# EasyEDA schematic ROBOT_SENSORS.json
TITLE: Sheet_1; REV: 1.0; Date: 2025-04-17; Sheet: 1/1; Drawn By: AmirB; Company: Your Company
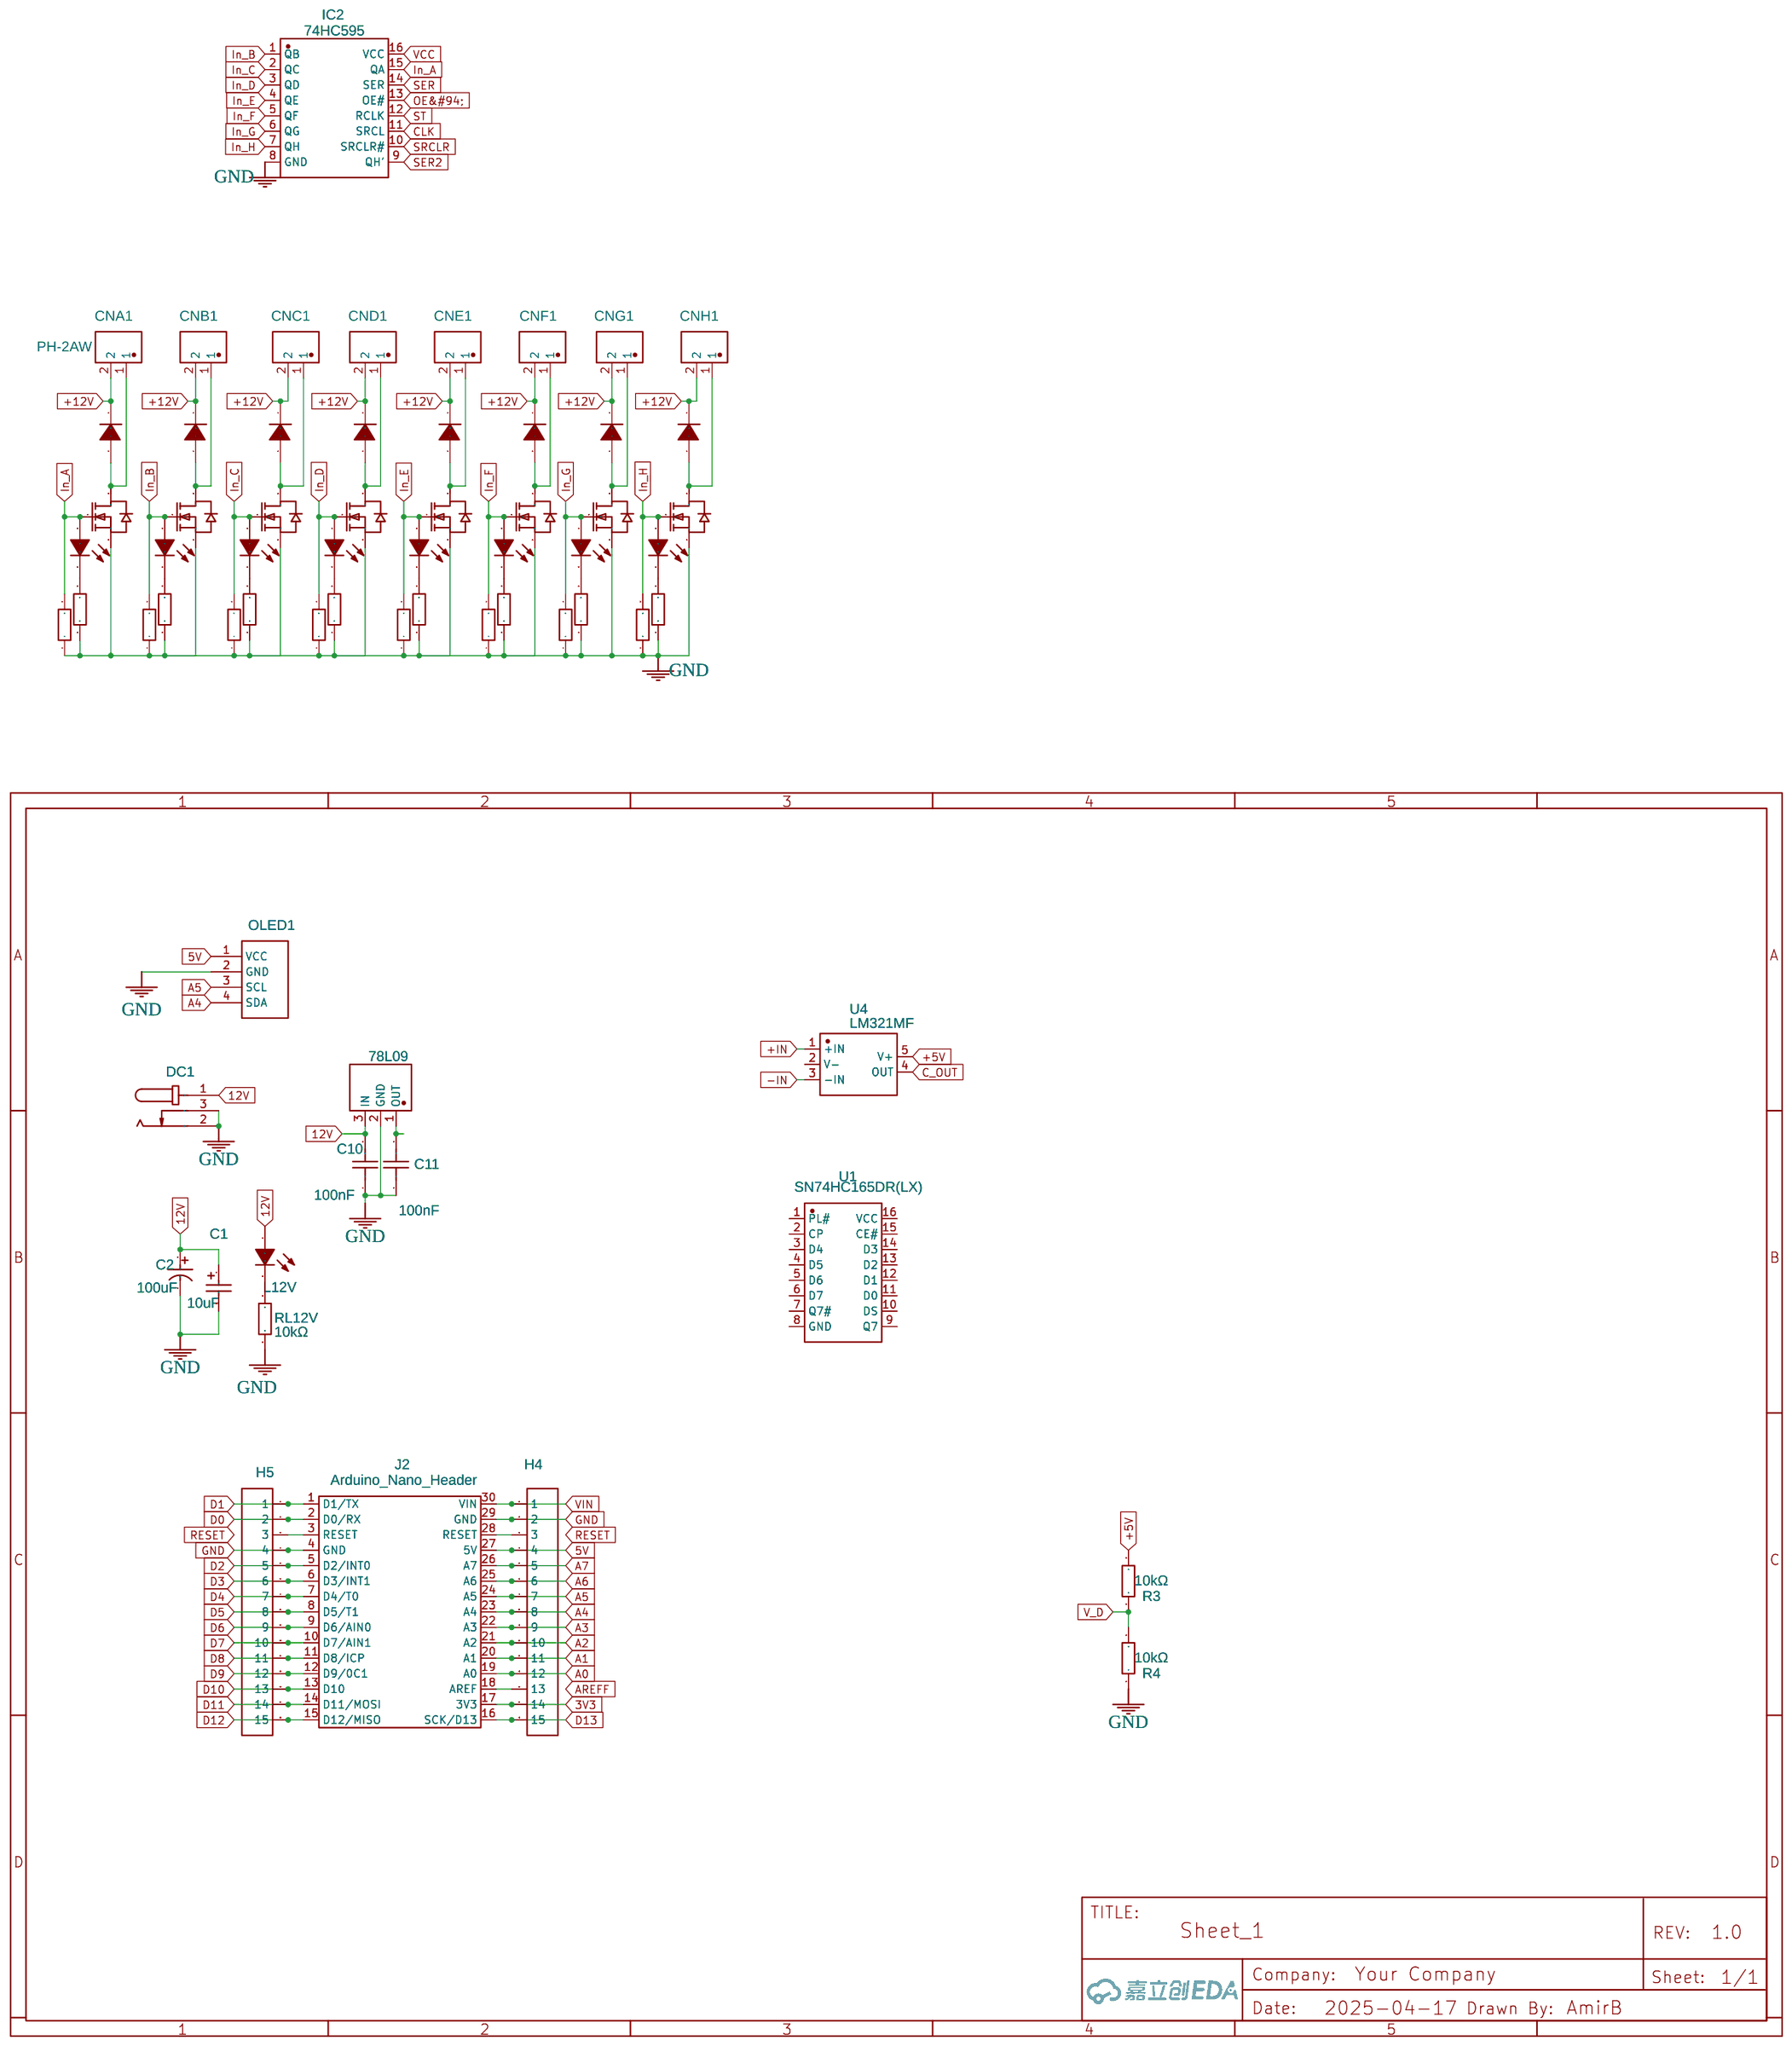
[diagram p0: schematic sheet]

## Parts
AD1  D  [SMA_L4.3-W2.6-LS5.2-RD]
ALED1  LED  [LED0603-R-RD_BLUE]
AQ1  Q  [SOT-23-3_L2.9-W1.3-P0.95-LS2.4-BR]
AR1  R10K  [R0603]
AR2  R10K  [R0603]
BD1  D  [SMA_L4.3-W2.6-LS5.2-RD]
BLED1  LED  [LED0603-R-RD_BLUE]
BQ1  Q  [SOT-23-3_L2.9-W1.3-P0.95-LS2.4-BR]
BR1  R10K  [R0603]
BR2  R10K  [R0603]
C1  10uF  [CAP-SMD_L3.2-W1.6-RD-C7171]
C2  100uF  [CAP-TH_BD6.3-P2.50-D1.0-FD]
C10  100nF  [C0603]
C11  100nF  [C0603]
CD1  D  [SMA_L4.3-W2.6-LS5.2-RD]
CLED1  LED  [LED0603-R-RD_BLUE]
CNA1  PH-2AW  [CONN-TH_PH-2AW]
CNB1  PH-2AW  [CONN-TH_PH-2AW]
CNC1  PH-2AW  [CONN-TH_PH-2AW]
CND1  PH-2AW  [CONN-TH_PH-2AW]
CNE1  PH-2AW  [CONN-TH_PH-2AW]
CNF1  PH-2AW  [CONN-TH_PH-2AW]
CNG1  PH-2AW  [CONN-TH_PH-2AW]
CNH1  PH-2AW  [CONN-TH_PH-2AW]
CQ1  Q  [SOT-23-3_L2.9-W1.3-P0.95-LS2.4-BR]
CR1  R10K  [R0603]
CR2  R10K  [R0603]
DC1  DC  [DC-IN-TH_DC005]
DD1  D  [SMA_L4.3-W2.6-LS5.2-RD]
DLED1  LED  [LED0603-R-RD_BLUE]
DQ1  Q  [SOT-23-3_L2.9-W1.3-P0.95-LS2.4-BR]
DR1  R10K  [R0603]
DR2  R10K  [R0603]
ED1  D  [SMA_L4.3-W2.6-LS5.2-RD]
ELED1  LED  [LED0603-R-RD_BLUE]
EQ1  Q  [SOT-23-3_L2.9-W1.3-P0.95-LS2.4-BR]
ER1  R10K  [R0603]
ER2  R10K  [R0603]
FD1  D  [SMA_L4.3-W2.6-LS5.2-RD]
FLED1  LED  [LED0603-R-RD_BLUE]
FQ1  Q  [SOT-23-3_L2.9-W1.3-P0.95-LS2.4-BR]
FR1  R10K  [R0603]
FR2  R10K  [R0603]
GD1  D  [SMA_L4.3-W2.6-LS5.2-RD]
GLED1  LED  [LED0603-R-RD_BLUE]
GQ1  Q  [SOT-23-3_L2.9-W1.3-P0.95-LS2.4-BR]
GR1  R10K  [R0603]
GR2  R10K  [R0603]
H4  HDR-F-2.54_1x15  [HDR-F-2.54_1X15]
H5  HDR-F-2.54_1x15  [HDR-F-2.54_1X15]
HD1  D  [SMA_L4.3-W2.6-LS5.2-RD]
HLED1  LED  [LED0603-R-RD_BLUE]
HQ1  Q  [SOT-23-3_L2.9-W1.3-P0.95-LS2.4-BR]
HR1  R10K  [R0603]
HR2  R10K  [R0603]
IC2  74HC595  [SOP-16_L10.0-W3.9-P1.27-LS6.0-BL]
J2  Arduino_Nano_Header  [DIP-30_L43.18-W15.24-ARDUINONANO]
L12V  LED  [LED0603-R-RD_BLUE]
OLED1  1.3 inch OLED SSH1106 I2C 128x64 copy  [1.3_OLED_SSH1106_I2C_128X64_BOARD]
R3  10kΩ  [R0603]
R4  10kΩ  [R0603]
RL12V  10kΩ  [R0603]
U1  SN74HC165DR(LX)  [SOP-16_L10.0-W3.9-P1.27-LS6.0-BL]
U4  LM321MF  [SOT-23-5_L2.9-W1.6-P0.95-LS2.8-BL]
U5  78L09  [SOT-89-3_L4.5-W2.5-P1.50-LS4.0-BR]

## Library data of the parts
AD1 BD1 CD1 DD1 ED1 FD1 GD1 HD1 = 1N4007F: Supplier: LCSC; Manufacturer: 晶导微电子; Manufacturer Part: ES1J; Supplier Part: C115404; JLCPCB Part Class: Extended Part; Package Display: No
ALED1 BLED1 CLED1 DLED1 ELED1 FLED1 GLED1 HLED1 L12V = 19-217/BHC-ZL1M2RY/3T: Supplier: LCSC; Manufacturer: EVERLIGHT; Supplier Part: C72041; JLCPCB Part Class: Basic Part; Package Display: No
AQ1 BQ1 CQ1 DQ1 EQ1 FQ1 GQ1 HQ1 = JSM2302: Supplier: LCSC; Supplier Part: C5224189; Manufacturer: ElecSuper(静芯微）; Manufacturer Part: AO3400; Contributor: LCSC; JLCPCB Part Class: Extended Part; Package Display: No
AR1 AR2 BR1 BR2 CR1 CR2 DR1 DR2 ER1 ER2 FR1 FR2 GR1 GR2 HR1 HR2 = 0603WAF1001T5E: Supplier: LCSC; Manufacturer: UniOhm; Manufacturer Part: 0603WAF1002T5E; Supplier Part: C25804; Resistance (Ohms): 10K; JLCPCB Part Class: Basic Part; Package Display: No
C1 = TAJA106K016RNJ: Supplier: LCSC; Manufacturer: Kyocera AVX; Supplier Part: C7171; JLCPCB Part Class: Basic Part; Package Display: No
C2 = 100uF 35V 6.3*11: Supplier: LCSC; Manufacturer: CX(承兴); Supplier Part: C19504; JLCPCB Part Class: Extended Part; Package Display: No
C10 C11 = CC0603KRX7R9BB104: JLCPCB Part Class: Basic Part; Package Display: No
CNA1 CNB1 CNC1 CND1 CNE1 CNF1 CNG1 CNH1 = PH-2AW: Contributor: LCSC; Supplier: LCSC; Supplier Part: C722769; Manufacturer: CAX(创都); JLCPCB Part Class: Extended Part; Package Display: No
DC1 = DC005-2.0MM: Supplier: LCSC; Manufacturer: SOFNG; Supplier Part: C111567; Package Display: No
H4 H5 = HDR-F-2.54_1x15: Supplier Part: C124408; Supplier: LCSC; Contributor: LCEDA_Lib; Package Display: No
IC2 = U74HC595AG-S16-R: Supplier: LCSC; Manufacturer: UTC; Supplier Part: C87300; JLCPCB Part Class: Extended Part; Package Display: No
J2 = Arduino_Nano_Header
OLED1 = 1.3 inch OLED SSH1106 I2C 128x64 copy: Contributor: Deguello; Package Display: No
R3 R4 = 0603WAF1002T5E: Supplier: LCSC; Manufacturer: UNI-ROYAL(厚声); Supplier Part: C25804; JLCPCB Part Class: Basic Part; Package Display: No
RL12V = 0603WAF1002T5E: Supplier: LCSC; Manufacturer: UNI-ROYAL(厚声); Supplier Part: C25804; Resistance (Ohms): 10K; JLCPCB Part Class: Basic Part; Package Display: No
U1 = SN74HC165DR(LX): Supplier: LCSC; Supplier Part: C22384789; Manufacturer: LX(灵星芯微); Contributor: lcsc; JLCPCB Part Class: Extended Part; Package Display: No
U4 = LM321MF: Contributor: LCSC; Supplier: LCSC; Supplier Part: C668208; Manufacturer: UMW(友台半导体); JLCPCB Part Class: Extended Part; Package Display: No
U5 = 78L09U 78L09: Contributor: LCSC; Supplier: LCSC; Supplier Part: C2875177; Manufacturer: CBI(创基); JLCPCB Part Class: Extended Part; Package Display: No

## Nets
3V3: H4.14 J2.17(3V3)
5V: H4.4 J2.27(5V) OLED1.1(VCC)
12V: C1.1 C2.1 C10.2 DC1.1 L12V.1(A) U5.3(IN)
+5V: R3.2 U4.5(V+)
+12V: AD1.1(C) BD1.1(C) CD1.1(C) CNA1.2 CNB1.2 CNC1.2 CND1.2 CNE1.2 CNF1.2 CNG1.2 CNH1.2 DD1.1(C) ED1.1(C) FD1.1(C) GD1.1(C) HD1.1(C)
GND: AQ1.2(S) AR1.1 AR2.1 BQ1.2(S) BR1.1 BR2.1 C1.2 C2.2 C10.1 C11.1 CQ1.2(S) CR1.1 CR2.1 DC1.2 DC1.3 DQ1.2(S) DR1.1 DR2.1 EQ1.2(S) ER1.1 ER2.1 FQ1.2(S) FR1.1 FR2.1 GQ1.2(S) GR1.1 GR2.1 H4.2 H5.4 HQ1.2(S) HR1.1 HR2.1 IC2.8(GND) J2.4(GND) J2.29(GND) OLED1.2(GND) R4.1 RL12V.2 U5.2(GND)
VCC: IC2.16(VCC)
VIN: H4.1 J2.30(VIN)
+IN: U4.1(+IN)
-IN: U4.3(-IN)
A0: H4.12 J2.19(A0)
A1: H4.11 J2.20(A1)
A2: H4.10 J2.21(A2)
A3: H4.9 J2.22(A3)
A4: H4.8 J2.23(A4) OLED1.4(SDA)
A5: H4.7 J2.24(A5) OLED1.3(SCL)
A6: H4.6 J2.25(A6)
A7: H4.5 J2.26(A7)
C_OUT: U4.4(OUT)
CLK: IC2.11(SRCL)
D0: H5.2 J2.2(D0/RX)
D1: H5.1 J2.1(D1/TX)
D2: H5.5 J2.5(D2/INT0)
D3: H5.6 J2.6(D3/INT1)
D4: H5.7 J2.7(D4/T0)
D5: H5.8 J2.8(D5/T1)
D6: H5.9 J2.9(D6/AIN0)
D7: H5.10 J2.10(D7/AIN1)
D8: H5.11 J2.11(D8/ICP)
D9: H5.12 J2.12(D9/0C1)
D10: H5.13 J2.13(D10)
D11: H5.14 J2.14(D11/MOSI)
D12: H5.15 J2.15(D12/MISO)
D13: H4.15 J2.16(SCK/D13)
In_A: ALED1.1(A) AQ1.1(G) AR1.2 IC2.15(QA)
In_B: BLED1.1(A) BQ1.1(G) BR1.2 IC2.1(QB)
In_C: CLED1.1(A) CQ1.1(G) CR1.2 IC2.2(QC)
In_D: DLED1.1(A) DQ1.1(G) DR1.2 IC2.3(QD)
In_E: ELED1.1(A) EQ1.1(G) ER1.2 IC2.4(QE)
In_F: FLED1.1(A) FQ1.1(G) FR1.2 IC2.5(QF)
In_G: GLED1.1(A) GQ1.1(G) GR1.2 IC2.6(QG)
In_H: HLED1.1(A) HQ1.1(G) HR1.2 IC2.7(QH)
OE&#94;: IC2.13(OE#)
SER: IC2.14(SER)
SER2: IC2.9(QH')
SRCLR: IC2.10(SRCLR#)
ST: IC2.12(RCLK)
V_D: R3.1 R4.2
Net-(AD1-2): AD1.2(A) AQ1.3(D) CNA1.1
Net-(ALED1-2): ALED1.2(C) AR2.2
Net-(BD1-2): BD1.2(A) BQ1.3(D) CNB1.1
Net-(BLED1-2): BLED1.2(C) BR2.2
Net-(C11-2): C11.2 U5.1(OUT)
Net-(CD1-2): CD1.2(A) CNC1.1 CQ1.3(D)
Net-(CLED1-2): CLED1.2(C) CR2.2
Net-(CND1-1): CND1.1 DD1.2(A) DQ1.3(D)
Net-(CNE1-1): CNE1.1 ED1.2(A) EQ1.3(D)
Net-(CNF1-1): CNF1.1 FD1.2(A) FQ1.3(D)
Net-(CNG1-1): CNG1.1 GD1.2(A) GQ1.3(D)
Net-(CNH1-1): CNH1.1 HD1.2(A) HQ1.3(D)
Net-(DLED1-2): DLED1.2(C) DR2.2
Net-(ELED1-2): ELED1.2(C) ER2.2
Net-(FLED1-2): FLED1.2(C) FR2.2
Net-(GLED1-2): GLED1.2(C) GR2.2
Net-(H4-3): H4.3 J2.28(RESET)
Net-(H4-13): H4.13 J2.18(AREF)
Net-(H5-3): H5.3 J2.3(RESET)
Net-(HLED1-2): HLED1.2(C) HR2.2
Net-(L12V-2): L12V.2(C) RL12V.1

Not connected (* = marked no-connect by the designer): U1 1(PL#) 2(CP) 3(D4) 4(D5) 5(D6) 6(D7) 7(Q7#) 8(GND) 9(Q7) 10(DS) 11(D0) 12(D1) 13(D2) 14(D3) 15(CE#) 16(VCC); U4 2(V-)
